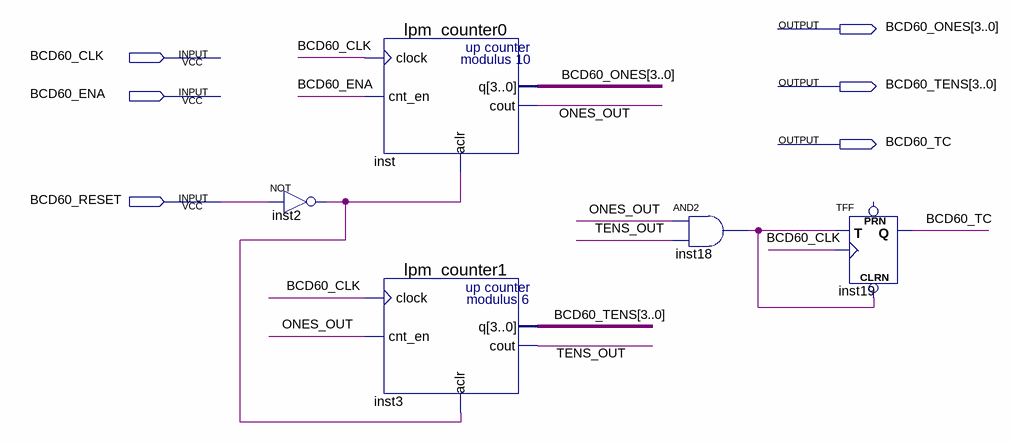
[diagram p0: schematic sheet]
// Quartus schematic Counter.bdf as structural Verilog: 5 symbols, 6 pins
module Counter (
  input  BCD60_CLK,
  input  BCD60_ENA,
  input  BCD60_RESET,
  output [3:0] BCD60_ONES,
  output [3:0] BCD60_TENS,
  output BCD60_TC
);

  wire inst2_out, inst18_out, ONES_OUT, TENS_OUT;

  not inst2 (inst2_out, BCD60_RESET);
  lpm_counter0 inst (.clock(BCD60_CLK), .cnt_en(BCD60_ENA), .aclr(inst2_out), .q(BCD60_ONES), .cout(ONES_OUT));
  lpm_counter1 inst3 (.clock(BCD60_CLK), .cnt_en(ONES_OUT), .aclr(inst2_out), .q(BCD60_TENS), .cout(TENS_OUT));
  and inst18 (inst18_out, ONES_OUT, TENS_OUT);
  TFF inst19 (.CLRN(inst18_out), .T(inst18_out), .CLK(BCD60_CLK), .Q(BCD60_TC));  // open: PRN
endmodule
